# EAGLE design ha-pc-switch-revA (EAGLE 9.6.2)

## Sheet 1 of 2
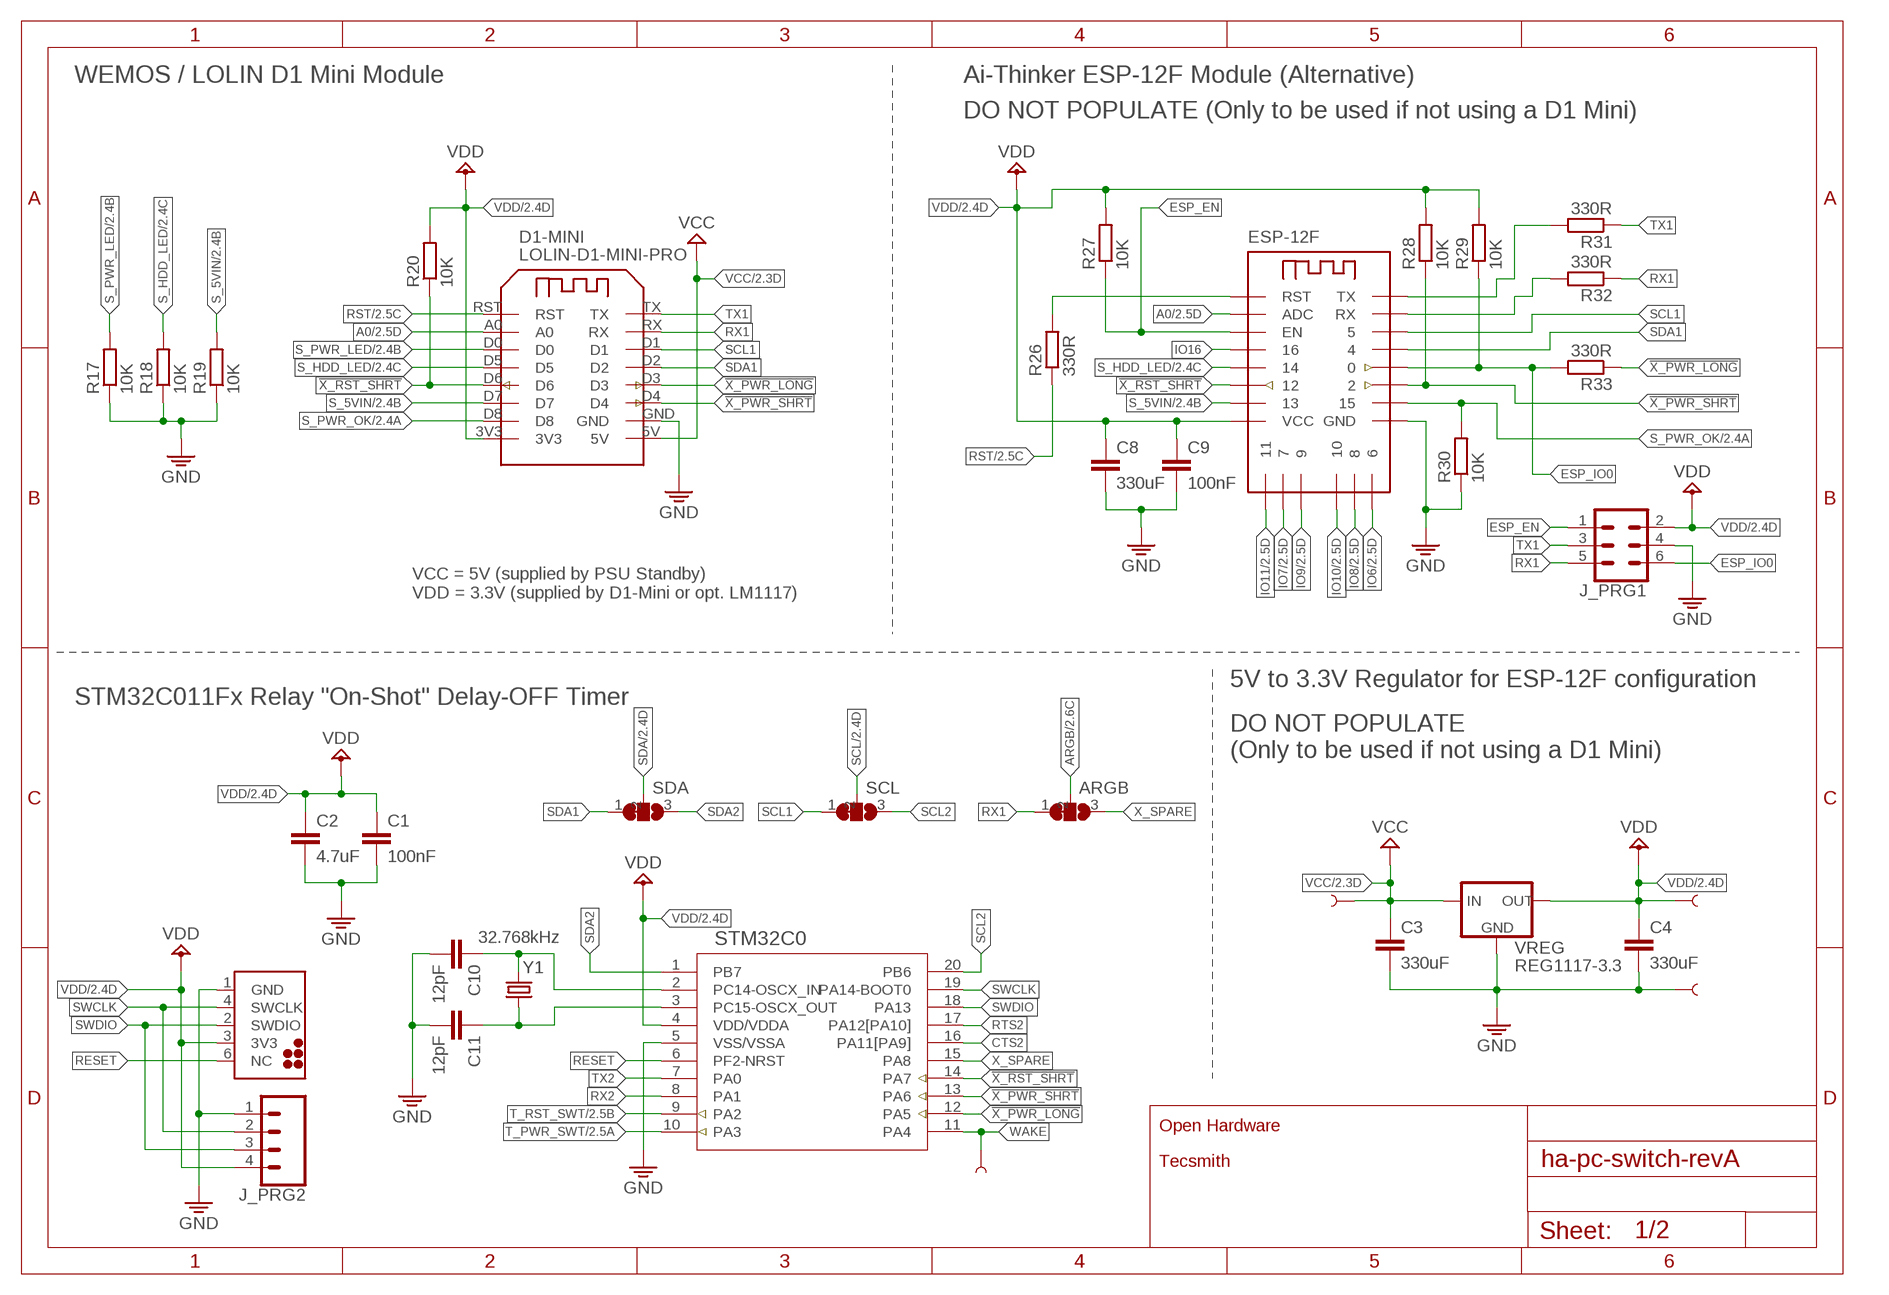
[diagram p0: schematic, sheet 1]

### Parts
ARGB  JUMPER-1X3-CLOSED  [SOLDERJUMPER_CLOSEDWIRE-3]
C1  100nF  C-EUC0603  [C0603]
C2  4.7uF  C-EUC0603  [C0603]
C3  330uF  C-EUC0603  [C0603]
C4  330uF  C-EUC0603  [C0603]
C8  330uF  C-EUC0603  [C0603]
C9  100nF  C-EUC0603  [C0603]
C10  12pF  C-EUC0603  [C0603]
C11  12pF  C-EUC0603  [C0603]
D1-MINI  LOLIN-D1-MINI-PRO  [WEMOS-D1-MINI-PRO]
ESP-12F  ESPRESSIF-ESP-12F&ESMD  [ESP8266-ESP-12E]
J_DBG2  NUCLEO_HEADER  [NUCLEO]
J_PRG1  CONN_03X2FEMALE_SMD  [2X3_SMD]
J_PRG2  1X04_SMD_STRAIGHT_COMBO  CONN_04SMD_STRAIGHT_COMBO  [1X04_SMD_VERTICAL_COMBO]
LOGO1  OSHW-LOGOM  [OSHW-LOGO-M]
R17  10K  R-EU_R0603  [R0603]
R18  10K  R-EU_R0603  [R0603]
R19  10K  R-EU_R0603  [R0603]
R20  10K  R-EU_R0603  [R0603]
R26  330R  R-EU_R0603  [R0603]
R27  10K  R-EU_R0603  [R0603]
R28  10K  R-EU_R0603  [R0603]
R29  10K  R-EU_R0603  [R0603]
R30  10K  R-EU_R0603  [R0603]
R31  330R  R-EU_R0603  [R0603]
R32  330R  R-EU_R0603  [R0603]
R33  330R  R-EU_R0603  [R0603]
SCL  JUMPER-1X3-CLOSED  [SOLDERJUMPER_CLOSEDWIRE-3]
SDA  JUMPER-1X3-CLOSED  [SOLDERJUMPER_CLOSEDWIRE-3]
STM32C0  STM32C011FTSSOP20_STM-M  [TSSOP20-M]
TP1  TEST-POINT3X5  [PAD.03X.05]
TP2  TEST-POINT3X5  [PAD.03X.05]
TP3  TEST-POINT3X5  [PAD.03X.05]
TP4  TEST-POINT3X5  [PAD.03X.05]
U$1  TECSMITH-LOGOLONG  [TECSMITH-NAME]
VREG  REG1117-3.3  [SOT223]
Y1  32.768kHz  CRYSTAL-32.768KHZSMD-3.2X1.5  [CRYSTAL-SMD-3.2X1.5MM]

### Nets
!X_PWR_LONG: D1-MINI.D3 R33.1 STM32C0.12(PA5)
!X_PWR_SHRT: D1-MINI.D4 ESP-12F.GPIO2 R28.1 STM32C0.13(PA6)
!X_RST_SHRT: D1-MINI.D6 ESP-12F.GPIO12 R20.1 STM32C0.14(PA7)
A0: D1-MINI.A0 ESP-12F.ADC0(ADC) ; also sheet 2
ARGB: ARGB.2 ; also sheet 2
CTS2: STM32C0.16(PA11[PA9])
ESP_EN: ESP-12F.EN J_PRG1.1 R27.1
ESP_IO0: ESP-12F.GPIO0 J_PRG1.6 R29.1 R33.2
GND: C1.2 C2.2 C3.2 C4.2 C8.2 C9.2 C10.2 C11.2 D1-MINI.GND ESP-12F.GND J_DBG2.1(GND) J_PRG1.4 J_PRG2.1 R17.1 R18.1 R19.1 R30.1 STM32C0.5(VSS/VSSA) TP3.1 VREG.1(GND) ; also sheet 2
IO6: ESP-12F.SCLK ; also sheet 2
IO7: ESP-12F.MISO ; also sheet 2
IO8: ESP-12F.MOSI ; also sheet 2
IO9: ESP-12F.GPIO9 ; also sheet 2
IO10: ESP-12F.GPIO10 ; also sheet 2
IO11: ESP-12F.CS0 ; also sheet 2
IO16: ESP-12F.GPIO16
N$10: C10.1 STM32C0.2(PC14-OSCX_IN) Y1.P$2
N$11: C11.1 STM32C0.3(PC15-OSCX_OUT) Y1.P$1
N$14: ESP-12F.RST R26.2
N$15: ESP-12F.RXD0(RX) R32.2
N$16: ESP-12F.TXD0(TX) R31.2
RESET: J_DBG2.6(NC) STM32C0.6(PF2-NRST)
RST: D1-MINI.RST R26.1 ; also sheet 2
RTS2: STM32C0.17(PA12[PA10])
RX1: ARGB.1 D1-MINI.RX J_PRG1.5 R32.1
RX2: STM32C0.8(PA1)
S_5VIN: D1-MINI.D7 ESP-12F.GPIO13 R19.2 ; also sheet 2
S_HDD_LED: D1-MINI.D5 ESP-12F.GPIO14 R18.2 ; also sheet 2
S_PWR_LED: D1-MINI.D0 R17.2 ; also sheet 2
S_PWR_OK: D1-MINI.D8 ESP-12F.GPIO15 R30.2 ; also sheet 2
SCL: SCL.2 ; also sheet 2
SCL1: D1-MINI.D1 ESP-12F.GPIO5 SCL.1
SCL2: SCL.3 STM32C0.20(PB6)
SDA: SDA.2 ; also sheet 2
SDA1: D1-MINI.D2 ESP-12F.GPIO4 SDA.1
SDA2: SDA.3 STM32C0.1(PB7)
SWCLK: J_DBG2.4(SWCLK) J_PRG2.2 STM32C0.19(PA14-BOOT0)
SWDIO: J_DBG2.2(SWDIO) J_PRG2.3 STM32C0.18(PA13)
T_PWR_SWT: STM32C0.10(PA3) ; also sheet 2
T_RST_SWT: STM32C0.9(PA2) ; also sheet 2
TX1: D1-MINI.TX J_PRG1.3 R31.1
TX2: STM32C0.7(PA0)
VCC: C3.1 D1-MINI.5V TP1.1 VREG.3(IN) ; also sheet 2
VDD: C1.1 C2.1 C4.1 C8.1 C9.1 D1-MINI.3V3 ESP-12F.VCC J_DBG2.3(3V3) J_PRG1.2 J_PRG2.4 R20.2 R27.2 R28.2 R29.2 STM32C0.4(VDD/VDDA) TP2.1 VREG.2(OUT) VREG.T(OUT) ; also sheet 2
WAKE: STM32C0.11(PA4) TP4.1
X_SPARE: ARGB.3 STM32C0.15(PA8)

### Notes on the sheet
- WEMOS / LOLIN D1 Mini Module | Ai-Thinker ESP-12F Module (Alternative)
- DO NOT POPULATE (Only to be used if not using a D1 Mini)
- VCC = 5V (supplied by PSU Standby)
  VDD = 3.3V (supplied by D1-Mini or opt. LM1117)
- 5V to 3.3V Regulator for ESP-12F configuration
- STM32C011Fx Relay "On-Shot" Delay-OFF Timer
- DO NOT POPULATE
  (Only to be used if not using a D1 Mini)

## Sheet 2 of 2
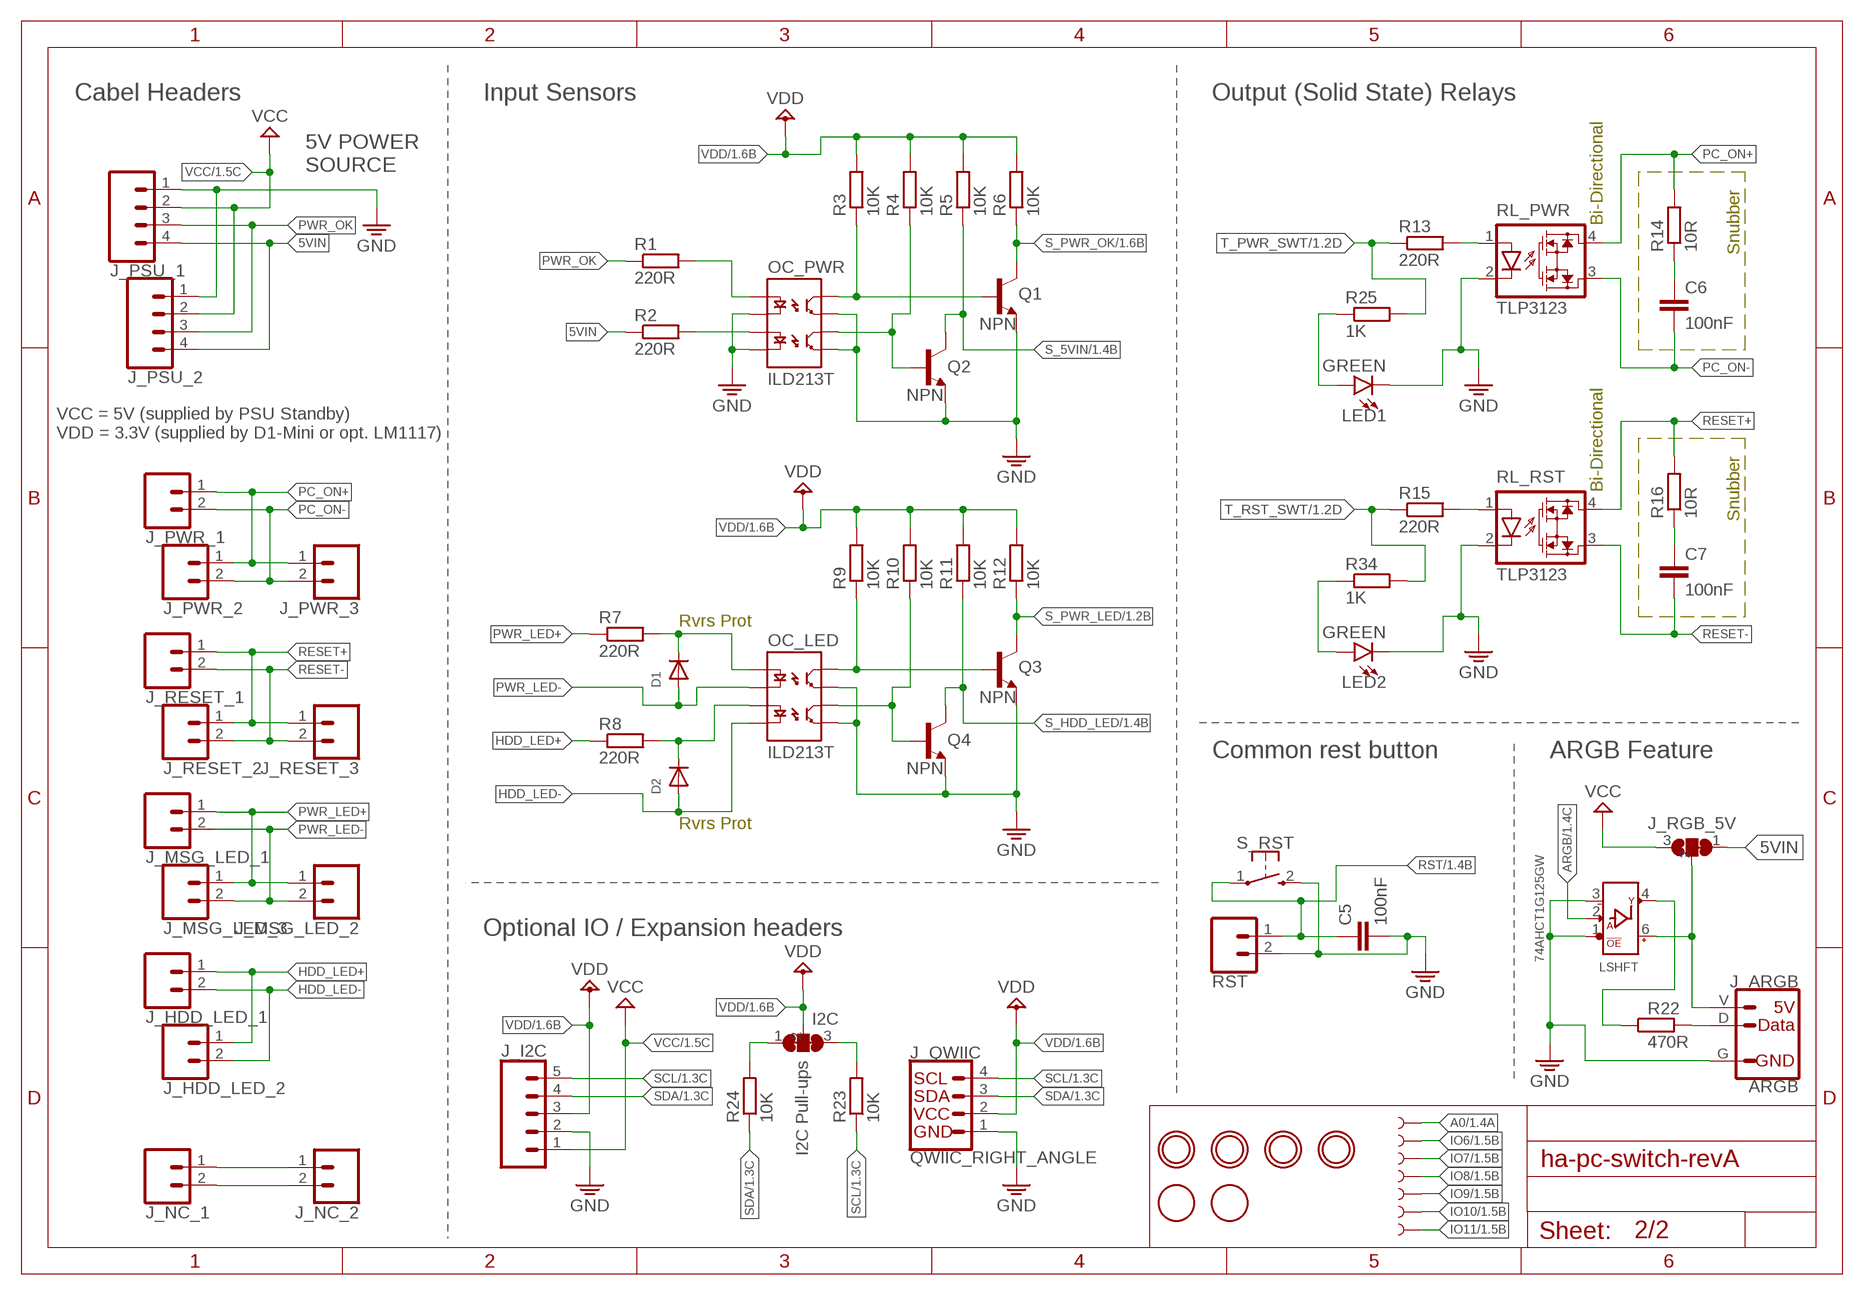
[diagram p1: schematic, sheet 2]

### Parts
C5  100nF  C-EUC0603  [C0603]
C6  100nF  C-EUC0603  [C0603]
C7  100nF  C-EUC0603  [C0603]
D1  DIODESOD-523  [SOD-523]
D2  DIODESOD-523  [SOD-523]
I2C  JUMPER-1X3-CLOSED-2  [SOLDERJUMPER_CLOSEDWIRE-3-2]
J_ARGB  ARGB  [ARGB]
J_HDD_LED_1  CONN_021X02_NO_SILK  [1X02_NO_SILK]
J_HDD_LED_2  CONN_021X02_NO_SILK  [1X02_NO_SILK]
J_I2C  CONN_05SCREW  [SCREWTERMINAL-3.5MM-5]
J_MSG_LED_1  CONN_021X02_NO_SILK  [1X02_NO_SILK]
J_MSG_LED_2  CONN_021X02_NO_SILK  [1X02_NO_SILK]
J_MSG_LED_3  CONN_02PTH3  [1X02_LONGPADS]
J_NC_1  CONN_021X02_NO_SILK  [1X02_NO_SILK]
J_NC_2  CONN_021X02_NO_SILK  [1X02_NO_SILK]
J_PSU_1  CONN_04LONGPADS  [1X04_LONGPADS]
J_PSU_2  CONN_04SCREW  [SCREWTERMINAL-3.5MM-4]
J_PWR_1  CONN_021X02_NO_SILK  [1X02_NO_SILK]
J_PWR_2  CONN_021X02_NO_SILK  [1X02_NO_SILK]
J_PWR_3  CONN_02PTH3  [1X02_LONGPADS]
J_QWIIC  QWIIC_RIGHT_ANGLE  QWIIC_CONNECTORJS-1MM  [JST04_1MM_RA]
J_RESET_1  CONN_021X02_NO_SILK  [1X02_NO_SILK]
J_RESET_2  CONN_021X02_NO_SILK  [1X02_NO_SILK]
J_RESET_3  CONN_02PTH3  [1X02_LONGPADS]
J_RGB_5V  JUMPER-1X3-CLOSEDPINS  [1X03_ROUND_CLOSED]
LED1  GREEN  LED-GREEN0603  [LED-0603]
LED2  GREEN  LED-GREEN0603  [LED-0603]
LSHFT  74AHCT1G125GW  [SC-88A__TSSOP5__SOT353-1]
OC_LED  ILD213T  OPTOISOLATOR-2SOIC8  [SO08-2]
OC_PWR  ILD213T  OPTOISOLATOR-2SOIC8  [SO08-2]
Q1  NPN  TRANSISTOR_NPNSOT23-3  [SOT23-3]
Q2  NPN  TRANSISTOR_NPNSOT23-3  [SOT23-3]
Q3  NPN  TRANSISTOR_NPNSOT23-3  [SOT23-3]
Q4  NPN  TRANSISTOR_NPNSOT23-3  [SOT23-3]
R1  220R  R-EU_R0603  [R0603]
R2  220R  R-EU_R0603  [R0603]
R3  10K  R-EU_R0603  [R0603]
R4  10K  R-EU_R0603  [R0603]
R5  10K  R-EU_R0603  [R0603]
R6  10K  R-EU_R0603  [R0603]
R7  220R  R-EU_R0603  [R0603]
R8  220R  R-EU_R0603  [R0603]
R9  10K  R-EU_R0603  [R0603]
R10  10K  R-EU_R0603  [R0603]
R11  10K  R-EU_R0603  [R0603]
R12  10K  R-EU_R0603  [R0603]
R13  220R  R-EU_R0603  [R0603]
R14  10R  R-EU_R0603  [R0603]
R15  220R  R-EU_R0603  [R0603]
R16  10R  R-EU_R0603  [R0603]
R22  470R  R-EU_R0603  [R0603]
R23  10K  R-EU_R0603  [R0603]
R24  10K  R-EU_R0603  [R0603]
R25  1K  R-EU_R0603  [R0603]
R34  1K  R-EU_R0603  [R0603]
RL_PWR  TLP3123  [SOP4_TOS]
RL_RST  TLP3123  [SOP4_TOS]
RST  CONN_021X02_NO_SILK  [1X02_NO_SILK]
S_RST  MOMENTARY-SWITCH-SPST-1  [SKRKAEE020]
TP9  TEST-POINT3X5  [PAD.03X.05]
TP10  TEST-POINT3X5  [PAD.03X.05]
TP11  TEST-POINT3X5  [PAD.03X.05]
TP12  TEST-POINT3X5  [PAD.03X.05]
TP14  TEST-POINT3X5  [PAD.03X.05]
TP15  TEST-POINT3X5  [PAD.03X.05]
TP16  TEST-POINT3X5  [PAD.03X.05]
U$5  MOUNTINGHOLE3.0THIN  [MOUNTINGHOLE_3.0_PLATEDTHIN]
U$9  MOUNTINGHOLE3.0THIN  [MOUNTINGHOLE_3.0_PLATEDTHIN]
U$11  MOUNTINGHOLE3.0THIN  [MOUNTINGHOLE_3.0_PLATEDTHIN]
U$12  MOUNTINGHOLE3.0THIN  [MOUNTINGHOLE_3.0_PLATEDTHIN]
U$15  FIDUCIAL  [FIDUCIAL_1MM]
U$16  FIDUCIAL  [FIDUCIAL_1MM]

### Nets
5VIN: J_PSU_1.4 J_PSU_2.4 J_RGB_5V.1 R2.1
A0: TP12.1 ; also sheet 1
ARGB: LSHFT.2(A_DIN) ; also sheet 1
GND: C5.2 J_ARGB.G J_I2C.2 J_PSU_1.1 J_PSU_2.1 J_QWIIC.1 LED1.C LED2.C LSHFT.1(!OE) LSHFT.3(3_GND) OC_LED.5(EM2) OC_LED.7(EM1) OC_PWR.2(C1) OC_PWR.4(C2) OC_PWR.5(EM2) OC_PWR.7(EM1) Q1.2(E) Q2.2(E) Q3.2(E) Q4.2(E) RL_PWR.2(C) RL_RST.2(C) RST.2 S_RST.2 ; also sheet 1
HDD_LED+: J_HDD_LED_1.1 J_HDD_LED_2.1 R8.1
HDD_LED-: D2.A J_HDD_LED_1.2 J_HDD_LED_2.2 OC_LED.4(C2)
IO6: TP11.1 ; also sheet 1
IO7: TP10.1 ; also sheet 1
IO8: TP9.1 ; also sheet 1
IO9: TP16.1 ; also sheet 1
IO10: TP15.1 ; also sheet 1
IO11: TP14.1 ; also sheet 1
N$1: OC_PWR.1(A1) R1.2
N$2: OC_PWR.3(A2) R2.2
N$3: J_NC_1.1 J_NC_2.1
N$4: J_NC_1.2 J_NC_2.2
N$5: R15.2 RL_RST.1(A)
N$6: D2.K(C) OC_LED.3(A2) R8.2
N$7: C6.1 R14.1
N$8: C7.1 R16.1
N$9: R13.2 RL_PWR.1(A)
N$12: J_ARGB.V J_RGB_5V.2 LSHFT.6(5_VCC)
N$13: D1.K(C) OC_LED.1(A1) R7.2
N$17: LSHFT.4(Y_DOUT) R22.1
N$18: J_ARGB.D R22.2
N$19: LED1.A R25.1
N$20: I2C.3 R23.2
N$21: I2C.1 R24.2
N$25: LED2.A R34.1
OUT1N: OC_PWR.8(CL1) Q1.1(B) R3.1
OUT1N1: OC_LED.8(CL1) Q3.1(B) R9.1
OUT2N: OC_PWR.6(CL2) Q2.1(B) R4.1
OUT2N1: OC_LED.6(CL2) Q4.1(B) R10.1
PC_ON+: J_PWR_1.1 J_PWR_2.1 J_PWR_3.1 R14.2 RL_PWR.4(D1)
PC_ON-: C6.2 J_PWR_1.2 J_PWR_2.2 J_PWR_3.2 RL_PWR.3(D2)
PWR_LED+: J_MSG_LED_1.1 J_MSG_LED_2.1 J_MSG_LED_3.1 R7.1
PWR_LED-: D1.A J_MSG_LED_1.2 J_MSG_LED_2.2 J_MSG_LED_3.2 OC_LED.2(C1)
PWR_OK: J_PSU_1.3 J_PSU_2.3 R1.1
RESET+: J_RESET_1.1 J_RESET_2.1 J_RESET_3.1 R16.2 RL_RST.4(D1)
RESET-: C7.2 J_RESET_1.2 J_RESET_2.2 J_RESET_3.2 RL_RST.3(D2)
RST: C5.1 RST.1 S_RST.1 ; also sheet 1
S_5VIN: Q2.3(C) R5.1 ; also sheet 1
S_HDD_LED: Q4.3(C) R11.1 ; also sheet 1
S_PWR_LED: Q3.3(C) R12.1 ; also sheet 1
S_PWR_OK: Q1.3(C) R6.1 ; also sheet 1
SCL: J_I2C.5 J_QWIIC.4 R23.1 ; also sheet 1
SDA: J_I2C.4 J_QWIIC.3 R24.1 ; also sheet 1
T_PWR_SWT: R13.1 R25.2 ; also sheet 1
T_RST_SWT: R15.1 R34.2 ; also sheet 1
VCC: J_I2C.1 J_PSU_1.2 J_PSU_2.2 J_RGB_5V.3 ; also sheet 1
VDD: I2C.2 J_I2C.3 J_QWIIC.2 R3.2 R4.2 R5.2 R6.2 R9.2 R10.2 R11.2 R12.2 ; also sheet 1

### Notes on the sheet
- Cabel Headers | Input Sensors | Output (Solid State) Relays
- 5V POWER
  SOURCE
- Snubber
- Bi-Directional
- VCC = 5V (supplied by PSU Standby)
  VDD = 3.3V (supplied by D1-Mini or opt. LM1117)
- Snubber
- Bi-Directional
- Rvrs Prot
- Common rest button | ARGB Feature
- Rvrs Prot
- Optional IO / Expansion headers
- I2C Pull-ups

## Library data of the parts
ARGB J_RGB_5V SCL SDA = ts_jumpers:JUMPER-1X3-CLOSED
C1-C11 = rcl:C-EU: CAPACITOR, European symbol; SPICEPREFIX: C
D1 D2 = adafruit:DIODE: Diode SMADIODE - SMA Surface Mount Package 20V 1A Schottky Diode Digikey: 641-1014-6-ND DO-1N4148 - Through Hole Small Current Diode SOD-123 20V 1 A (.5mV Vf) Schottky Diode - Digikey: MBRX120TPMSCT-ND SOD-323 10V 570mA (.38mV Vf, 3ns) Schottky Diode - Digikey: ZLLS410CT-ND SOD-523 30V 30mA Schottky Diode (RB751S-40TE61) - Digikey: RB751S-40TE61CT-ND SOT23-R/W - SOT23 Package (R = Solder Paste/Reflow Ovens, W = Hand-Soldering) BAT54Film 40V 300mA - Digikey: 497-7162-1-ND
D1-MINI = ts_dev_boards:LOLIN-D1-MINI-PRO
ESP-12F = ts_dev_boards:ESPRESSIF-ESP-12F&E: ESP12E Module
I2C = ts_jumpers:JUMPER-1X3-CLOSED-2
J_ARGB = __temp_to_delete:ARGB
J_DBG2 = stm32c0:NUCLEO_HEADER
J_HDD_LED_1 J_HDD_LED_2 J_MSG_LED_1-J_MSG_LED_3 J_NC_1 J_NC_2 J_PWR_1-J_PWR_3 J_RESET_1-J_RESET_3 RST = SparkFun-Connectors:CONN_02: Multi connection point. Often used as Generic Header-pin footprint for 0.1 inch spaced/style header connections On any of the 0.1 inch spaced packages, you can populate with these: Break Away Headers - Straight <https://www.sparkfun.com/products/116> (PRT-00116) Break Away Male Headers - Right Angle <https://www.sparkfun.com/products/553> (PRT-00553) Female Headers <https://www.sparkfun.com/products/115> (PRT-00115) Break Away Headers - Machine Pin <https://www.sparkfun.com/products/117> (PRT-00117) Break Away Female Headers - Swiss Machine Pin <https://www.sparkfun.com/products/743> (PRT-00743) For SCREWTERMINALS and SPRING TERMINALS visit here: Screw Terimnals on SparkFun.com <https://www.sparkfun.com/search/results?term=Screw+Terminals> (5mm/3.5mm/2.54mm spacing) This device is also useful as a general connection point to wire up your design to another part of your project. Our various solder wires solder well into these plated through hole pads. Hook-Up Wire - Assortment (Stranded, 22 AWG) <https://www.sparkfun.com/products/11375> (PRT-11375) Hook-Up Wire - Assortment (Solid Core, 22 AWG) <https://www.sparkfun.com/products/11367> (PRT-11367) View the entire wire category on our website here <https://www.sparkfun.com/categories/141> Special notes: Molex polarized connector foot print use with: PRT-08233 with associated crimp pins and housings. 2.54_SCREWTERM for use with PRT-10571. 3.5mm Screw Terminal footprints for PRT-08084 5mm Screw Terminal footprints for use with PRT-08432
J_I2C = SparkFun-Connectors:CONN_05: Multi connection point. Often used as Generic Header-pin footprint for 0.1 inch spaced/style header connections On any of the 0.1 inch spaced packages, you can populate with these: Break Away Headers - Straight <https://www.sparkfun.com/products/116> (PRT-00116) Break Away Male Headers - Right Angle <https://www.sparkfun.com/products/553> (PRT-00553) Female Headers <https://www.sparkfun.com/products/115> (PRT-00115) Break Away Headers - Machine Pin <https://www.sparkfun.com/products/117> (PRT-00117) Break Away Female Headers - Swiss Machine Pin <https://www.sparkfun.com/products/743> (PRT-00743) For SCREWTERMINALS and SPRING TERMINALS visit here: Screw Terimnals on SparkFun.com <https://www.sparkfun.com/search/results?term=Screw+Terminals> (5mm/3.5mm/2.54mm spacing) This device is also useful as a general connection point to wire up your design to another part of your project. Our various solder wires solder well into these plated through hole pads. Hook-Up Wire - Assortment (Stranded, 22 AWG) <https://www.sparkfun.com/products/11375> (PRT-11375) Hook-Up Wire - Assortment (Solid Core, 22 AWG) <https://www.sparkfun.com/products/11367> (PRT-11367) View the entire wire category on our website here <https://www.sparkfun.com/categories/141> Special notes: Molex polarized connector foot print use with SKU : PRT-08231 with associated crimp pins and housings. 1MM SMD Version SKU: PRT-10208; PROD_ID: Combine 8288+8399
J_PRG1 = SparkFun-Connectors:CONN_03X2: Multi connection point. Often used as Generic Header-pin footprint for 0.1 inch spaced/style header connections You can populate with any combo of single row headers, but if you'd like an exact match, check these: Header - 2x3 (Male, 0.1") <https://www.sparkfun.com/products/12807> (PRT-12807) Header - 2x3 (Female, 0.1") <https://www.sparkfun.com/products/13010> (PRT-13010) 2x3 Pin Shrouded Header <https://www.sparkfun.com/products/10877> (PRT-10877) On any of the 0.1 inch spaced packages, you can populate with these: Break Away Headers - Straight <https://www.sparkfun.com/products/116> (PRT-00116) Break Away Male Headers - Right Angle <https://www.sparkfun.com/products/553> (PRT-00553) Female Headers <https://www.sparkfun.com/products/115> (PRT-00115) Break Away Headers - Machine Pin <https://www.sparkfun.com/products/117> (PRT-00117) Break Away Female Headers - Swiss Machine Pin <https://www.sparkfun.com/products/743> (PRT-00743) Special note: the shrouded connector mates well with our 3x2 ribbon cables: Ribbon Crimp Connector - 6-pin (2x3, Female) <https://www.sparkfun.com/products/10651> (PRT-10651) Ribbon Cable - 6 wire (15ft) <https://www.sparkfun.com/products/10646> (PRT-10646); PROD_ID: CONN-11290
J_PRG2 = SparkFun-Connectors:CONN_04: Multi connection point. Often used as Generic Header-pin footprint for 0.1 inch spaced/style header connections On any of the 0.1 inch spaced packages, you can populate with these: Break Away Headers - Straight <https://www.sparkfun.com/products/116> (PRT-00116) Break Away Male Headers - Right Angle <https://www.sparkfun.com/products/553> (PRT-00553) Female Headers <https://www.sparkfun.com/products/115> (PRT-00115) Break Away Headers - Machine Pin <https://www.sparkfun.com/products/117> (PRT-00117) Break Away Female Headers - Swiss Machine Pin <https://www.sparkfun.com/products/743> (PRT-00743) For SCREWTERMINALS and SPRING TERMINALS visit here: Screw Terimnals on SparkFun.com <https://www.sparkfun.com/search/results?term=Screw+Terminals> (5mm/3.5mm/2.54mm spacing) This device is also useful as a general connection point to wire up your design to another part of your project. Our various solder wires solder well into these plated through hole pads. Hook-Up Wire - Assortment (Stranded, 22 AWG) <https://www.sparkfun.com/products/11375> (PRT-11375) Hook-Up Wire - Assortment (Solid Core, 22 AWG) <https://www.sparkfun.com/products/11367> (PRT-11367) View the entire wire category on our website here <https://www.sparkfun.com/categories/141> Special notes: Molex polarized connector foot print use with SKU : PRT-08231 with associated crimp pins and housings. 1MM SMD Version SKU: PRT-10208; PROD_ID: CONN-08511
J_PSU_1 = SparkFun-Connectors:CONN_04: Multi connection point. Often used as Generic Header-pin footprint for 0.1 inch spaced/style header connections On any of the 0.1 inch spaced packages, you can populate with these: Break Away Headers - Straight <https://www.sparkfun.com/products/116> (PRT-00116) Break Away Male Headers - Right Angle <https://www.sparkfun.com/products/553> (PRT-00553) Female Headers <https://www.sparkfun.com/products/115> (PRT-00115) Break Away Headers - Machine Pin <https://www.sparkfun.com/products/117> (PRT-00117) Break Away Female Headers - Swiss Machine Pin <https://www.sparkfun.com/products/743> (PRT-00743) For SCREWTERMINALS and SPRING TERMINALS visit here: Screw Terimnals on SparkFun.com <https://www.sparkfun.com/search/results?term=Screw+Terminals> (5mm/3.5mm/2.54mm spacing) This device is also useful as a general connection point to wire up your design to another part of your project. Our various solder wires solder well into these plated through hole pads. Hook-Up Wire - Assortment (Stranded, 22 AWG) <https://www.sparkfun.com/products/11375> (PRT-11375) Hook-Up Wire - Assortment (Solid Core, 22 AWG) <https://www.sparkfun.com/products/11367> (PRT-11367) View the entire wire category on our website here <https://www.sparkfun.com/categories/141> Special notes: Molex polarized connector foot print use with SKU : PRT-08231 with associated crimp pins and housings. 1MM SMD Version SKU: PRT-10208; PROD_ID: CONN-09696
J_PSU_2 = SparkFun-Connectors:CONN_04: Multi connection point. Often used as Generic Header-pin footprint for 0.1 inch spaced/style header connections On any of the 0.1 inch spaced packages, you can populate with these: Break Away Headers - Straight <https://www.sparkfun.com/products/116> (PRT-00116) Break Away Male Headers - Right Angle <https://www.sparkfun.com/products/553> (PRT-00553) Female Headers <https://www.sparkfun.com/products/115> (PRT-00115) Break Away Headers - Machine Pin <https://www.sparkfun.com/products/117> (PRT-00117) Break Away Female Headers - Swiss Machine Pin <https://www.sparkfun.com/products/743> (PRT-00743) For SCREWTERMINALS and SPRING TERMINALS visit here: Screw Terimnals on SparkFun.com <https://www.sparkfun.com/search/results?term=Screw+Terminals> (5mm/3.5mm/2.54mm spacing) This device is also useful as a general connection point to wire up your design to another part of your project. Our various solder wires solder well into these plated through hole pads. Hook-Up Wire - Assortment (Stranded, 22 AWG) <https://www.sparkfun.com/products/11375> (PRT-11375) Hook-Up Wire - Assortment (Solid Core, 22 AWG) <https://www.sparkfun.com/products/11367> (PRT-11367) View the entire wire category on our website here <https://www.sparkfun.com/categories/141> Special notes: Molex polarized connector foot print use with SKU : PRT-08231 with associated crimp pins and housings. 1MM SMD Version SKU: PRT-10208; PROD_ID: CONN-14485
J_QWIIC = ts_custom_nick_nacks:QWIIC_CONNECTOR: SparkFun I2C Standard Qwiic Connector An SMD 1mm pitch JST connector makes it easy and quick (get it? Qwiic?) to connect I2C devices to each other. The Qwiic system <http://www.sparkfun.com/qwiic> enables fast and solderless connection between popular platforms and various sensors and actuators. We carry 200mm <https://www.sparkfun.com/products/14204>, 100mm <https://www.sparkfun.com/products/14205>, 50mm <https://www.sparkfun.com/products/14206>, and breadboard friendly <https://www.sparkfun.com/products/14207> Qwiic cables. We also offer 10 pcs strips <https://www.sparkfun.com/products/14323> the SMD connectors.; PROD_ID: CONN-13694
LED1 LED2 = SparkFun-LED:LED-GREEN: Green SMD LED Used in manufacturing of various products at SparkFun Packages: 0603 - SMD 0603 package [Product Link] <http://www.futureelectronics.com/en/technologies/semiconductors/optoelectronics/leds/Pages/9894312-LTST-C190GKT.aspx?CrossPart=HSMG-C190&IM=0> LilyPad 1206 - SMD1206 LilyPad package [Product Link] <http://www.futureelectronics.com/en/Technologies/Product.aspx?ProductID=IN150NGHARVATEKCORPORATION2049943&IM=0> 1206 - SMD1206 package [Product Link] <http://www.futureelectronics.com/en/technologies/semiconductors/optoelectronics/leds/Pages/8315665-LTST-C150KGKT.aspx?IM=0> 1206 Bottom Mount -SMD 1206 Bottom Mount [Product Link] <http://www.digikey.com/product-detail/en/lite-on-inc/LTST-C230KGKT/160-1456-1-ND/386854> SparkFun Products: Pro Mini 328 -5V <https://www.sparkfun.com/products/821> RedBoard <https://www.sparkfun.com/products/12757> MP3 Trigger <https://www.sparkfun.com/products/13720> Makey Makey <https://www.sparkfun.com/products/11076>; PROD_ID: DIO-00821
LOGO1 = random_logos:OSHW-LOGO: Open-Source Hardware (OSHW) Logo This logo indicates the piece of hardware it is found on incorporates a OSHW license and/or adheres to the definition of open source hardware found here: http://freedomdefined.org/OSHW
LSHFT = ts_keyboards:74AHCT1G125GW
OC_LED OC_PWR = SparkFun:OPTOISOLATOR-2: Description: Dual gate opto isolator. Vishay part : ILD213T
Q1-Q4 = SparkFun:TRANSISTOR_NPN: Transistor NPN BJT configuration in SOT23 package. MMBT2222 is the common NPN we use. Double check BCE configuration again layout.
R1-R20 R22-R34 = rcl:R-EU_: RESISTOR, European symbol; SPICEPREFIX: R
RL_PWR RL_RST = __untitled:TLP3123
S_RST = ts_custom_nick_nacks:MOMENTARY-SWITCH-SPST-1: Momentary Switch (Pushbutton) - SPST - Two Circuits Normally-open (NO) SPST momentary switches (buttons, pushbuttons). Schematic symbol includes two switch circuits. Variants SMD-4.6MMX2.8MM - 4.60mm x 2.80mm Tactile Momentary Button Switch - Used on SparkFun SAMD21 Mini Breakout <https://www.sparkfun.com/products/13664> SMD-5.2MM - Mini Pushbutton Switch - SMD <https://www.sparkfun.com/products/8720> - Used on Arduino Pro Mini <https://www.sparkfun.com/products/11114>
STM32C0 = stm32c0:STM32C011F; COPYRIGHT: Copyright (C) 2024 Ultra Librarian. All rights reserved.; MANUFACTURER_PART_NUMBER: STM32C011F4P6; MFR_NAME: STMicroelectronics
TP1-TP4 TP9-TP12 TP14-TP16 = SparkFun-Connectors:TEST-POINT: SparkFun Test Points Bare copper test points for troubleshooting or In-Circuit-Testing. These are used by our Production team for verifying production board runs using pogo-pins on test beds. SparkFun Products: SparkFun LSM9DS1 Breakout <https://www.sparkfun.com/products/13284> SparkFun PSOC <https://www.sparkfun.com/products/13714> SparkFun Load Cell Amplifier <https://www.sparkfun.com/products/13879>
U$1 = random_logos:TECSMITH-LOGO
U$5 U$9 U$11 U$12 = ts_custom_nick_nacks:MOUNTINGHOLE: Mounting Hole For #2 screws (0.086"/2.18mm width, 0.094"/2.4mm hole) use 2.5mm; BOM: EXCLUDE
U$15 U$16 = adafruit:FIDUCIAL: For use by pick and place machines to calibrate the vision/machine, 1mm By microbuilder.eu
VREG = ts_custom_nick_nacks:REG1117-3.3: Low Dropout Positive Regulator
Y1 = SparkFun-Clocks:CRYSTAL-32.768KHZ: 32.768kHz Crystal Frequency: 32.768kHz Frequency Stability: ±20ppm Load Capacitance: 12.5pF (PTH-2X6 & SMD-3.2X1.5), 6pF (SMD-2X6) SparkFun Products: SparkFun BigTime Watch Kit <https://www.sparkfun.com/products/11734> SparkFun nRF52832 Breakout <https://www.sparkfun.com/products/13990> SparkFun Real Time Clock Module <https://www.sparkfun.com/products/12708>; PROD_ID: XTAL-13062

## Board
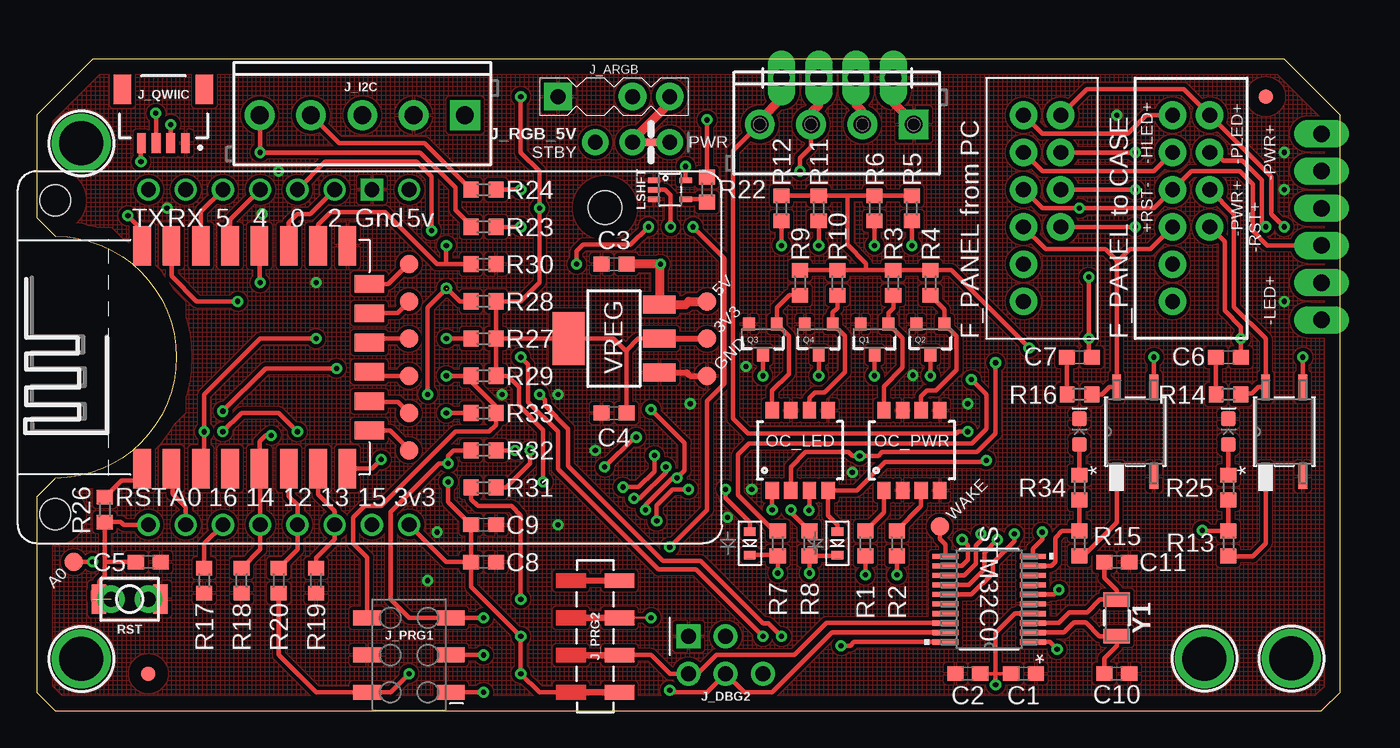
[diagram p2: board, top side]
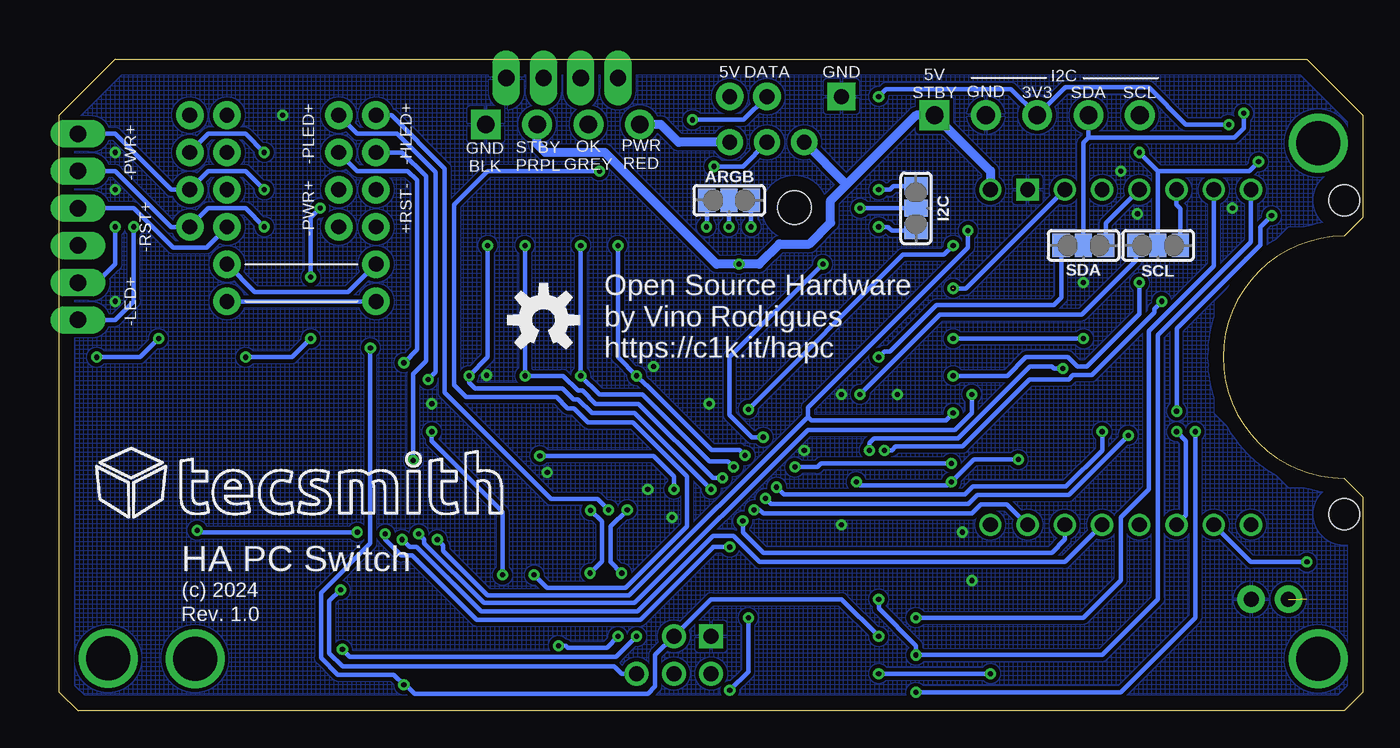
[diagram p3: board, bottom side, seen from below]

Size 88.9 x 44.45 mm. Coordinates in mm from the lower left corner, seen from the top.
Outline: 1.27,0 87.63,0 88.9,1.27 88.9,40.64 85.09,44.45 3.81,44.45 0,40.64 0,33.65 1.27,32.38 arc-180 1.27,15.88 0,14.61 0,1.27 1.27,0
Copper layers (1*16): Top 0.035mm / dielectric 1.5mm / Bottom 0.035mm
Design rules "default": minimum track width 6mil, minimum drill 0.35mm, track to track 6mil, track to pad 6mil, pad to pad 6mil, via to via 6mil, smd to smd 6mil, copper to edge 40mil, drill to drill 6mil, minimum pad ring 10mil, minimum via ring 8mil, stop-mask expansion 4mil, vias tented up to drill 0mil, thermal gap 10mil

### Footprints (pad centres in the part's own frame; a part is rotated, then mirrored left to right if it is on the bottom)
SOLDERJUMPER_CLOSEDWIRE-3 = smd 1.168 x 1.6: 1 -1.524,0; 2 0,0; 3 1.524,0 | smd 0.635 x 0.203: WIRE -0.762,0
C0603 = smd 1.1 x 1: 1 -0.85,0; 2 0.85,0
SOD-523 = smd 0.8 x 0.6: A 0,-0.8; K 0,0.8
WEMOS-D1-MINI-PRO = drill 1: 3V3 -11.43,-2.8; 5V 11.43,-2.8; A0 -11.43,12.44; D0 -11.43,9.9; D1 11.43,9.9; D2 11.43,7.36; D3 11.43,4.82; D4 11.43,2.28; D5 -11.43,7.36; D6 -11.43,4.82; D7 -11.43,2.28; D8 -11.43,-0.26; RST -11.43,14.98; RX 11.43,12.44; TX 11.43,14.98 | drill 1 square: GND 11.43,-0.26 | hole 2.1: -10.7,21.34; 10.7,21.34 | hole 2.3: 10.2,-16.16
ESP8266-ESP-12E = smd 2.7 x 1.2: ADC0 -7.6,3.5; EN -7.6,1.5; GND 7.6,-8.5; GPIO0 7.6,-2.5; GPIO2 7.6,-4.5; GPIO4 7.6,-0.5; GPIO5 7.6,1.5; GPIO12 -7.6,-4.5; GPIO13 -7.6,-6.5; GPIO14 -7.6,-2.5; GPIO15 7.6,-6.5; GPIO16 -7.6,-0.5; RST -7.6,5.5; RXD0 7.6,3.5; TXD0 7.6,5.5; VCC -7.6,-8.5 | smd 1.2 x 2: CS0 -5,-10; GPIO9 -1,-10; GPIO10 1,-10; MISO -3,-10; MOSI 3,-10; SCLK 5,-10
SOLDERJUMPER_CLOSEDWIRE-3-2 = smd 1.168 x 1.6: 1 -1.524,0; 2 0,0; 3 1.524,0 | smd 0.635 x 0.203: WIRE1 -0.762,0; WIRE2 0.762,0
ARGB = drill 1.016 pad 1.88: D 2.54,0; V 0,0 | drill 1.016 pad 1.88 square: G 7.62,0
NUCLEO = drill 1.016 pad 1.626 square: 1 -1.27,-1.27 | drill 1.016 pad 1.626: 2 1.27,-1.27; 3 -1.27,1.27; 4 1.27,1.27; 6 1.27,3.81
1X02_NO_SILK = drill 1.016 pad 1.88: 1 0,0; 2 2.54,0
SCREWTERMINAL-3.5MM-5 = drill 1.2 pad 2.032 square: 1 0,0 | drill 1.2 pad 2.032: 2 3.5,0; 3 7,0; 4 10.5,0; 5 14,0
1X02_LONGPADS = drill 1.118 pad 1.88 long: 1 0,0; 2 2.54,0
2X3_SMD = smd 1.02 x 1.9: 1 -2.54,-2.85; 2 -2.54,2.85; 3 0,-2.85; 4 0,2.85; 5 2.54,-2.85; 6 2.54,2.85
1X04_SMD_VERTICAL_COMBO = smd 1 x 2: 1 0,1.65; 2 2.54,1.65; 3 5.08,1.65; 4 7.62,1.652
1X04_LONGPADS = drill 1.118 pad 1.88 long: 1 0,0; 2 2.54,0; 3 5.08,0; 4 7.62,0
SCREWTERMINAL-3.5MM-4 = drill 1.2 pad 2.032 square: 1 0,0 | drill 1.2 pad 2.032: 2 3.5,0; 3 7,0; 4 10.5,0
JST04_1MM_RA = smd 0.6 x 1.35: 1 -1.5,0; 2 -0.5,0; 3 0.5,0; 4 1.5,0 | smd 1.2 x 2: NC1 2.8,-3.675; NC2 -2.8,-3.675
1X03_ROUND_CLOSED = drill 1 pad 1.778: 1 -1.27,0; 2 1.27,0; 3 3.81,0 | smd 1.016 x 0.508: WIRE 0,0
LED-0603 = smd 1 x 1: A -0.877,0; C 0.877,0
SC-88A__TSSOP5__SOT353-1 = smd 0.375 x 0.825: 1 -0.65,-1.087; 2 0,-1.087; 3 0.65,-1.087; 4 0.65,1.087; 6 -0.65,1.087
SO08-2 = smd 0.914 x 1.143: 1 -1.905,-2.731; 2 -0.635,-2.731; 3 0.635,-2.731; 4 1.905,-2.731; 5 1.905,2.731; 6 0.635,2.731; 7 -0.635,2.731; 8 -1.905,2.731
SOT23-3 = smd 0.8 x 0.9: 1 -0.95,-1; 2 0.95,-1; 3 0,1.1
R0603 = smd 1 x 1.1: 1 -0.85,0; 2 0.85,0
SOP4_TOS = smd 1.7 x 0.6: 1 -3.061,1.27; 2 -3.061,-1.27; 3 3.061,-1.27; 4 3.061,1.27
SKRKAEE020 = smd 1 x 2: 1 -2.1,0; 2 2.1,0
TSSOP20-M = smd 1.778 x 0.356: 1 -2.972,2.925; 2 -2.972,2.275; 3 -2.972,1.625; 4 -2.972,0.975; 5 -2.972,0.325; 6 -2.972,-0.325; 7 -2.972,-0.975; 8 -2.972,-1.625; 9 -2.972,-2.275; 10 -2.972,-2.925; 11 2.972,-2.925; 12 2.972,-2.275; 13 2.972,-1.625; 14 2.972,-0.975; 15 2.972,-0.325; 16 2.972,0.325; 17 2.972,0.975; 18 2.972,1.625; 19 2.972,2.275; 20 2.972,2.925
PAD.03X.05 = smd 1.27 x 1.27: 1 0,0
MOUNTINGHOLE_3.0_PLATEDTHIN = drill 3 pad 3.6: P$1 0,0
FIDUCIAL_1MM = smd 1 x 1: 1 0,0
SOT223 = smd 1.219 x 2.235: 1 -2.311,-3.099; 2 0,-3.099; 3 2.311,-3.099 | smd 3.6 x 2.2: T 0,3.099
CRYSTAL-SMD-3.2X1.5MM = smd 1 x 1.8: P$1 -1.25,0; P$2 1.25,0

### Placement (x,y rotation side)
ARGB  43.22,34.83 180 bottom
C1  67.31,2.54 0 top
C2  63.5,2.54 180 top
C3  39.37,30.48 180 top
C4  39.37,20.32 180 top
C5  7.62,10.16 0 top
C6  81.28,24.13 0 top
C7  71.12,24.13 0 top
C8  30.48,10.16 0 top
C9  30.48,12.7 0 top
C10  73.66,2.54 0 top
C11  73.66,10.16 0 top
D1  48.64,11.43 180 top
D1-MINI  22.61,24.13 90 top
D2  54.61,11.43 180 top
ESP-12F  12.7,24.13 90 top
I2C  30.48,34.29 270 bottom
J_ARGB  43.18,41.91 180 top
J_DBG2  45.72,3.81 270 top
J_HDD_LED_1  77.47,40.64 270 top
J_HDD_LED_2  67.31,40.64 270 top
J_I2C  29.21,40.64 180 top
J_MSG_LED_1  80.01,40.64 270 top
J_MSG_LED_2  69.85,40.64 270 top
J_MSG_LED_3  87.63,29.21 270 top
J_NC_1  77.47,27.94 90 top
J_NC_2  67.31,27.94 90 top
J_PRG1  25.4,3.81 90 top
J_PRG2  38.1,8.89 270 top
J_PSU_1  58.42,43.18 180 top
J_PSU_2  59.82,40 180 top
J_PWR_1  80.01,35.56 270 top
J_PWR_2  69.85,35.56 270 top
J_PWR_3  87.63,39.37 270 top
J_QWIIC  8.65,38.73 180 top
J_RESET_1  77.47,33.02 90 top
J_RESET_2  67.31,33.02 90 top
J_RESET_3  87.63,34.29 270 top
J_RGB_5V  41.91,38.8 180 top
LED1  81.28,19.05 90 top
LED2  71.12,19.05 90 top
LOGO1  55.88,26.67 0 bottom
LSHFT  43.18,35.56 270 top
OC_LED  52.07,17.78 0 top
OC_PWR  59.69,17.78 0 top
Q1  57.15,25.4 180 top
Q2  60.96,25.4 180 top
Q3  49.53,25.4 180 top
Q4  53.34,25.4 180 top
R1  56.52,11.43 90 top
R2  58.67,11.43 90 top
R3  58.42,29.21 90 top
R4  60.96,29.21 90 top
R5  59.69,34.29 90 top
R6  57.15,34.29 90 top
R7  50.55,11.43 270 top
R8  52.7,11.43 270 top
R9  52.07,29.21 90 top
R10  54.61,29.21 90 top
R11  53.34,34.29 90 top
R12  50.8,34.29 90 top
R13  81.28,11.43 270 top
R14  81.28,21.59 0 top
R15  71.12,11.43 270 top
R16  71.12,21.59 0 top
R17  11.43,8.89 90 top
R18  13.97,8.89 90 top
R19  19.05,8.89 90 top
R20  16.51,8.89 270 top
R22  45.72,35.56 90 top
R23  30.48,33.02 0 top
R24  30.48,35.56 0 top
R25  81.28,15.24 270 top
R26  4.65,13.73 90 top
R27  30.48,25.4 0 top
R28  30.48,27.94 0 top
R29  30.48,22.86 0 top
R30  30.48,30.48 180 top
R31  30.48,15.24 0 top
R32  30.48,17.78 0 top
R33  30.48,20.32 0 top
R34  71.12,15.24 270 top
RL_PWR  85.09,19.05 90 top
RL_RST  74.93,19.05 90 top
RST  5.08,7.62 0 top
S_RST  6.35,7.62 0 top
SCL  13.97,31.75 180 bottom
SDA  19.05,31.75 180 bottom
STM32C0  64.96,7.62 180 top
TP1  45.72,27.94 90 top
TP2  45.72,25.4 180 top
TP3  45.72,22.86 0 top
TP4  61.59,12.57 0 top
TP9  25.4,27.94 0 top
TP10  25.4,20.32 0 top
TP11  25.4,30.48 0 top
TP12  2.54,10.16 0 top
TP14  25.4,17.78 0 top
TP15  25.4,25.4 0 top
TP16  25.4,22.86 0 top
U$1  84.01,15.68 0 bottom
U$5  3.05,38.73 0 top
U$9  3.05,3.55 0 top
U$11  85.58,3.57 0 top
U$12  79.65,3.56 0 top
U$15  7.62,2.54 0 top
U$16  83.82,41.91 0 top
VREG  39.37,25.4 90 top
Y1  73.66,6.35 270 top

### Tracks (layer width: path | path; a pad name or v marks a point on that pad's centre or on a via)
5VIN  (via drill 0.35)
  Top 0.305: R2.1 v58.67,9.27 | v63.5,19.05 62.87,19.05 62.74,18.92 48.51,18.92 47.5,19.94 47.5,38.23 49.28,40 J_PSU_2.4
  Top 0.61: J_PSU_1.4 50.8,41.79 49.32,40.3 J_PSU_2.4
  Bottom 0.305: v63.5,19.05 63.5,18.41 58.67,13.59 v58.67,9.27
  Bottom 0.61: J_RGB_5V.1 46.67,38.8 47.88,40 J_PSU_2.4
!X_PWR_LONG  (via drill 0.35)
  Top 0.305: R33.1 v27.94,20.32 | D1-MINI.D3 19.69,37.46 25.91,37.46 26.92,36.45 v26.92,32.77 | v63.12,11.68 63.5,11.3 63.5,10.29 63.11,9.89 STM32C0.12
  Bottom 0.305: 37.85,20.07 50.04,7.87 59.69,7.87 62.74,10.92 62.74,11.3 v63.12,11.68 | v27.94,20.32 28.45,19.81 37.59,19.81 37.85,20.07 | 37.85,20.07 37.85,20.7 26.92,31.62 v26.92,32.77
!X_PWR_SHRT  (via drill 0.35)  (1 unrouted)
  Top 0.305: R28.1 28.87,27.94 27.98,28.83 | v27.94,28.83 27.94,28.79 26.67,27.52 v26.67,21.59 | D1-MINI.D4 19.06,34.29 19.05,34.29 18.67,33.91 17.78,33.91 17.2,33.33 ESP-12F.GPIO2 | STM32C0.13 63.28,9.25 64.07,10.03 64.07,11.3 64.39,11.62 v64.39,12.07
  Bottom 0.305: v27.94,28.83 27.06,28.83 D1-MINI.D4 | v26.67,21.59 26.67,20.32 27.81,19.18 37.85,19.18 49.66,7.37 59.94,7.37 64.01,11.43 64.01,11.68 v64.39,12.07
!X_RST_SHRT  (via drill 0.35)
  Top 0.305: ESP-12F.GPIO12 17.2,14.62 17.79,14.04 D1-MINI.D6 17.79,11.02 R20.1 | STM32C0.14 63.59,8.6 64.64,9.65 64.64,10.79 v65.53,11.68
  Bottom 0.305: D1-MINI.D6 20.33,10.16 41.15,10.16 42.93,11.94 44.32,11.94 49.48,6.78 60.13,6.78 64.53,11.18 65.02,11.18 v65.53,11.68
A0  (via drill 0.35)
  Top 0.305: TP12.1 v3.81,10.16 | ESP-12F.ADC0 9.27,16.46 9.27,14.8 10.17,13.9 D1-MINI.A0
  Bottom 0.305: D1-MINI.A0 7.63,10.16 v3.81,10.16
ARGB  (via drill 0.35)
  Top 0.305: LSHFT.2 42.86,35.56 43.24,35.18 v43.24,33.02
  Bottom 0.305: ARGB.2 43.22,33.04 v43.24,33.02
ESP_EN  (via drill 0.35)
  Top 0.305: R27.1 v27.94,25.4 | v30.48,1.27 J_PRG1.1 | v19.05,25.4 15.24,25.4 11.43,21.59 v11.43,19.05 11.43,16.76 ESP-12F.EN
  Bottom 0.305: v19.05,25.4 v27.94,25.4 | v30.48,1.27 16.51,1.27 11.43,6.35 v11.43,19.05
ESP_IO0  (via drill 0.35)
  Top 0.305: v27.94,22.86 R29.1 29.63,22.48 31.33,20.78 R33.2 31.33,19.52 30.86,19.05 28.57,19.05 23.49,13.97 22.35,13.97 21.59,13.21 21.59,11.43 22.55,10.47 J_PRG1.6 | v15.24,29.21 15.2,29.25 ESP-12F.GPIO0
  Bottom 0.305: v27.94,22.86 24.26,22.86 22.99,24.13 20.12,24.13 19.48,23.5 18.81,23.5 15.24,27.06 v15.24,29.21
GND  (via drill 0.35)
  Top 0.406: VREG.1 44.35,23.09 44.58,22.86 TP3.1
  Top 0.61: J_PSU_1.1 58.42,41.5 59.82,40.1 J_PSU_2.1
  other vias: 8.89,34.29 15.37,33.91 19.05,29.21 85.09,27.94 85.09,38.1 85.09,35.56 73.66,40.64 59.76,22.9 48.39,23.5 44.58,20.96 26.67,8.89 35.56,12.7 38.1,17.78 35.56,21.59 16.51,36.83 27.3,12.19 31.75,21.59 47.12,13.21 63.5,20.96 48.77,15.11 55.63,16.26
  pour Bottom (isolate 0.254, hatched): 0,1.27 1.27,0 87.63,0 88.9,1.27 88.9,40.64 85.09,44.45 3.81,44.45 0,40.64 0,34.29 1.27,33.02 3.81,33.02 5.08,33.02 10.16,27.94 10.16,20.32 5.08,15.24 3.81,15.24 1.27,15.24 0,13.97
  pour Top (isolate 0.254, hatched): 0,1.27 1.27,0 87.63,0 88.9,1.27 88.9,40.64 85.09,44.45 3.81,44.45 0,40.64 0,34.29 1.27,33.02 5.08,33.02 10.16,27.94 10.16,20.32 5.08,15.24 1.27,15.24 0,13.97
HDD_LED+  (via drill 0.35)
  Top 0.305: J_HDD_LED_1.1 75.69,40.64 74.42,39.37 68.58,39.37 J_HDD_LED_2.1 | R8.1 51.43,13.55 v51.43,13.72
  Bottom 0.305: J_HDD_LED_2.1 66.24,40.64 62.61,37.01 62.61,21.72 55.37,14.48 52.2,14.48 v51.43,13.72
HDD_LED-  (via drill 0.35)
  Top 0.305: D2.A 54.61,12.7 53.98,13.34 OC_LED.4 55.94,15.05 57.86,16.97 64.39,16.97 64.52,17.1 v64.77,17.1 | J_HDD_LED_1.2 76.2,36.83 68.58,36.83 J_HDD_LED_2.2
  Bottom 0.305: J_HDD_LED_2.2 65.51,38.1 63.88,36.47 63.88,23.86 64.77,22.97 v64.77,17.1
IO6
  Top 0.305: ESP-12F.SCLK 23.97,29.13 25.32,30.48 TP11.1
IO7
  Top 0.305: ESP-12F.MISO 22.75,21.08 24.64,21.08 TP10.1
IO8
  Top 0.305: TP9.1 25.4,27.93 24.6,27.13 ESP-12F.MOSI
IO9
  Top 0.305: TP16.1 22.97,22.86 ESP-12F.GPIO9
IO10
  Top 0.305: ESP-12F.GPIO10 22.97,25.4 TP15.1
IO11
  Top 0.305: TP14.1 25.4,17.83 24.1,19.13 ESP-12F.CS0
N$1
  Top 0.305: OC_PWR.1 57.79,13.55 R1.2
N$2
  Top 0.305: OC_PWR.3 60.32,13.97 58.67,12.32 R2.2
N$3
  Bottom 0.305: J_NC_2.1 J_NC_1.1
N$4
  Bottom 0.305: J_NC_2.2 69.22,28.57 75.57,28.57 J_NC_1.2
N$5
  Top 0.305: R15.2 71.37,10.58 73.66,12.87 RL_RST.1
N$6  (via drill 0.35)
  Top 0.305: D2.K 54.56,10.58 R8.2 v52.7,9.4 | v52.67,13.68 52.7,13.72 OC_LED.3
  Bottom 0.305: v52.67,13.68 51.91,12.92 51.91,10.2 v52.7,9.4
N$7
  Top 0.305: C6.1 R14.1
N$8
  Top 0.305: C7.1 R16.1
N$9
  Top 0.305: R13.2 81.32,10.54 82.93,10.54 83.82,11.43 RL_PWR.1
N$10
  Top 0.305: C10.1 72.81,3.59 73.66,4.44 Y1.P$2 72.48,5.1 71.55,6.03 70.75,6.03 70.07,5.35 STM32C0.2
N$11
  Top 0.305: C11.1 72.81,9.07 73.66,8.22 Y1.P$1 72.52,7.6 71.65,6.73 70.45,6.73 69.72,5.99 STM32C0.3
N$12  (via drill 0.35)
  Top 0.305: LSHFT.6 v44.27,37.14 v44.26,37.15
  Top 0.61: J_RGB_5V.2 40.95,39.1 40.95,39.24 43.18,41.48 J_ARGB.V
  Bottom 0.305: v44.26,37.15 42.29,37.15 J_RGB_5V.2
N$13  (via drill 0.35)
  Top 0.305: 48.59,10.58 D1.K 50.5,10.63 R7.2 v50.55,9.4 | v50.16,13.72 OC_LED.1
  Bottom 0.305: v50.55,9.4 51.31,10.16 51.31,12.57 v50.16,13.72
N$14
  Top 0.305: R26.2 5.8,15.73 6.65,15.73 7.2,16.28 ESP-12F.RST
N$15  (via drill 0.35)
  Top 0.305: ESP-12F.RXD0 9.2,29.66 10.92,27.94 v13.72,27.94 | R32.2 v32.64,17.78
  Bottom 0.305: v32.64,17.78 32.13,17.78 31.88,18.03 27.3,18.03 22.73,22.61 20.07,22.61 19.76,22.91 18.49,22.91 14.22,27.18 14.22,27.43 v13.72,27.94
N$16  (via drill 0.35)
  Top 0.305: ESP-12F.TXD0 7.2,32.8 v6.22,33.78 | v20.45,23.37 15.62,23.37 v12.7,20.45 | v33.66,17.78 33.66,16.89 32,15.24 R31.2
  Bottom 0.305: v6.22,33.78 6.99,33.02 6.99,31.79 7.93,30.85 | 7.93,30.85 | 7.93,30.85 12.7,26.07 v12.7,20.45 | v20.45,23.37 21.08,23.37 21.21,23.5 22.72,23.5 27.62,18.59 33.35,18.59 33.66,18.29 v33.66,17.78
N$17
  Top 0.305: LSHFT.4 45.52,34.91 R22.1
N$18  (via drill 0.35)
  Top 0.305: v45.72,40.32 R22.2
  Bottom 0.305: v45.72,40.32 42.23,40.32 J_ARGB.D
N$19
  Top 0.305: LED1.A R25.1
N$20  (via drill 0.35)
  Top 0.305: R23.2 v33.02,33.02
  Bottom 0.305: v33.02,33.02 32.38,33.02 32.13,32.77 I2C.3
N$21  (via drill 0.35)
  Top 0.305: v33.02,35.56 R24.2
  Bottom 0.305: I2C.1 32,35.81 32.26,35.56 v33.02,35.56
N$25
  Top 0.305: LED2.A R34.1
OUT1N
  Top 0.305: Q1.1 57.85,26.15 | Q1.1 58.1,27.15 58.42,27.47 R3.1 | Q1.1 59.05,25.45 59.05,23.41 57.79,22.14 OC_PWR.8
OUT1N1
  Top 0.305: R9.1 51.33,28.36 50.48,27.51 Q3.1 51.31,25.57 51.31,22.99 50.16,21.84 OC_LED.8
OUT2N
  Top 0.305: Q2.1 61.85,26.34 | Q2.1 61.91,27.38 60.96,28.33 R4.1 | Q2.1 62.74,25.57 62.74,23.24 61.34,21.84 60.71,21.84 60.32,21.46 OC_PWR.6
OUT2N1
  Top 0.305: R10.1 54.61,27.48 54.29,27.16 Q4.1 55.12,25.57 55.12,23.11 53.72,21.72 53.09,21.72 52.7,21.34 OC_LED.6
PC_ON+  (via drill 0.35)
  Top 0.305: R14.2 82.19,21.65 82.87,21.65 83.33,22.11 RL_PWR.4 83.82,25.4 81.66,27.56 81.66,33.91 J_PWR_1.1 | J_PWR_2.1 v74.93,35.56
  Bottom 0.305: J_PWR_3.1 85.09,39.37 81.28,35.56 J_PWR_1.1 78.74,36.83 76.2,36.83 v74.93,35.56
PC_ON-  (via drill 0.35)
  Top 0.305: C6.2 v82.13,25.4 82.13,26.2 81.03,27.3 81.03,32 J_PWR_1.2 | RL_PWR.3 v86.36,24.13 | v74.93,33.02 J_PWR_2.2
  Bottom 0.305: J_PWR_3.2 85.09,36.83 81.28,33.02 J_PWR_1.2 78.74,34.29 76.2,34.29 v74.93,33.02 | v86.36,24.13 83.4,24.13 v82.13,25.4
PWR_LED+  (via drill 0.35)
  Top 0.305: J_MSG_LED_2.1 71.63,42.42 78.23,42.42 J_MSG_LED_1.1 84.2,36.45 84.2,33.91 v85.09,33.02 | R7.1 50.29,12.28 47.84,14.73 47.84,17.49 48.59,18.24 63.78,18.24 64.77,19.23 64.77,21.59 v63.75,22.61
  Bottom 0.305: v85.09,33.02 85.09,30.48 86.36,29.21 J_MSG_LED_3.1 | J_MSG_LED_2.1 68.58,39.37 65.88,39.37 63.25,36.74 63.25,23.11 v63.75,22.61
PWR_LED-  (via drill 0.35)
  Top 0.305: J_MSG_LED_2.2 v74.93,38.1 | J_MSG_LED_1.2 80.39,38.1 80.95,37.54 82.23,37.54 83.57,36.21 83.57,33.27 v83.82,33.02 | v65.41,23.75 65.41,18.92 64.14,17.65 57.66,17.65 57.4,17.4 v56.13,17.4 55.63,17.4 55.37,17.65 52.45,17.65 51.43,16.64 OC_LED.2 | D1.A 48.64,12.87 46.99,14.52 v46.99,15.11
  Bottom 0.305: v74.93,38.1 76.2,39.37 78.74,39.37 J_MSG_LED_1.2 | v83.82,33.02 83.82,27.94 85.09,26.67 J_MSG_LED_3.2 | J_MSG_LED_2.2 68.58,36.83 65.15,36.83 64.52,36.2 64.52,24.64 v65.41,23.75 | v56.13,17.4 48.39,17.4 46.99,16 v46.99,15.11
PWR_OK  (via drill 0.35)
  Top 0.305: J_PSU_2.3 52.82,38.47 52.07,37.72 v52.07,36.83 | R1.1 v56.52,9.27
  Top 0.61: J_PSU_2.3 52.82,40.8 53.34,41.33 J_PSU_1.3
  Bottom 0.305: v52.07,36.83 59.69,36.83 61.98,34.54 61.98,22.23 61.15,21.4 54.99,21.4 54.23,20.64 53.78,20.64 52.83,19.68 49.78,19.68 46.1,16 46.1,12.57 50.29,8.38 55.63,8.38 v56.52,9.27
RESET  (via drill 0.35)
  Top 0.305: STM32C0.6 69.41,7.95 v69.72,8.26
  Bottom 0.305: v69.72,8.26 70.48,7.49 70.48,3.94 69.6,3.05 51.05,3.05 50.55,2.54 J_DBG2.6
RESET+
  Top 0.305: 72.35,21.97 R16.2 72.64,21.59 73.17,22.11 RL_RST.4 73.66,30.61 | J_RESET_1.1 75.95,31.5 74.55,31.5 73.66,30.61 | J_RESET_2.1 68.83,31.5 72.9,31.5 73.66,30.73 73.66,30.61
  Bottom 0.305: J_RESET_1.1 78.87,31.62 81.15,31.62 83.82,34.29 J_RESET_3.1
RESET-  (via drill 0.35)
  Top 0.305: J_RESET_3.2 83.95,31.75 82.93,32.77 82.93,35.94 82.04,36.83 78.74,36.83 J_RESET_1.2 76.2,34.29 v71.12,34.29 68.58,34.29 J_RESET_2.2 | v71.76,29.59 v71.76,25.4 71.76,24.34 C7.2 | RL_RST.3 v76.2,24.13
  Bottom 0.305: v71.12,34.29 71.76,33.65 v71.76,29.59 | v76.2,24.13 73.03,24.13 v71.76,25.4
RST  (2 unrouted)
  Top 0.305: D1-MINI.RST 5.93,12.7 5.75,12.88 R26.1 4.65,10.16 | 3.84,7.62 3.84,8.14 4.25,8.55 4.25,8.82 4.65,9.22 4.65,10.16 | C5.1 4.65,10.16
RX1  (via drill 0.35)
  Top 0.305: R32.1 28.45,17.78 28.07,17.4 v28.07,16.89 27.43,16.89 24.13,13.59 24.13,7.62 25.4,6.35 J_PRG1.5 v30.48,6.35 | v41.72,33.02 40.51,31.81 37.27,31.81 36.83,31.37 v36.83,30.48 | v38.73,16.64 40.77,18.67 v40.89,18.67
  Bottom 0.305: D1-MINI.RX 10.17,30.35 14.6,25.91 14.6,15.11 16.51,13.21 16.51,8.89 19.05,6.35 v30.48,6.35 | v28.07,16.89 36.96,16.89 37.21,16.64 v38.73,16.64 | v40.89,18.67 41.66,18.67 43.18,20.19 43.18,24.13 v36.83,30.48 | ARGB.1 41.72,34.81 v41.72,33.02
S_5VIN  (via drill 0.35)
  Top 0.305: ESP-12F.GPIO13 19.2,14.78 20.33,13.65 D1-MINI.D7 20.33,11.7 19.05,10.42 R19.2 | Q2.3 v60.96,22.86 | R5.1 v59.69,31.75 | v44.45,15.11 43.37,15.11 42.29,14.03 v42.29,12.95
  Bottom 0.305: v59.69,31.75 59.69,24.13 v60.96,22.86 60.96,22.4 60.56,21.99 54.58,21.99 53.85,21.26 53.52,21.26 52.58,20.32 49.66,20.32 v44.45,15.11 | v42.29,12.95 42.29,12.19 40.89,10.79 21.22,10.79 20.33,11.68 D1-MINI.D7
S_HDD_LED  (via drill 0.35)
  Top 0.305: R18.2 15.25,11.02 D1-MINI.D5 15.25,16.48 ESP-12F.GPIO14 15.2,18.38 15.62,18.8 v16,18.8 | Q4.3 v53.34,22.86 | R11.1 v53.34,31.75 | v42.91,16.65 42.91,16.27 41.13,14.49 v40.75,14.49
  Bottom 0.305: v53.34,31.75 v53.34,22.86 52.07,21.59 49.12,21.59 44.56,17.03 43.29,17.03 v42.91,16.65 | v40.75,14.49 40.37,14.11 26.91,14.11 26.29,14.73 20.07,14.73 v16,18.8
S_PWR_LED  (via drill 0.35)
  Top 0.305: R17.2 11.43,11.42 D1-MINI.D0 | Q3.3 v49.53,22.86 | R12.1 v50.8,31.75 | v39.98,15.26 41.06,15.26 42.14,16.34 v42.14,17.42 | v17.78,19.05 16.51,20.32 13.97,20.32 v12.7,19.05
  Bottom 0.305: v50.8,31.75 50.8,24.13 v49.53,22.86 48.89,22.23 48.85,22.23 44.43,17.8 42.52,17.8 v42.14,17.42 | v39.98,15.26 39.47,14.75 27.16,14.75 26.59,15.32 20.24,15.32 17.78,17.78 v17.78,19.05 | v12.7,19.05 12.07,18.42 12.07,13.34 D1-MINI.D0
S_PWR_OK  (via drill 0.35)
  Top 0.305: Q1.3 v57.15,22.86 | R6.1 v57.15,31.75 | ESP-12F.GPIO15 19.2,33.17 20.07,34.04 23.75,34.04 27.3,30.48 27.94,30.48 | 27.94,30.48 R30.2 | v41.52,13.72 41.52,14.04 43.36,15.88 v43.68,15.88 44.2,16.4 44.2,18.29 v41.91,20.57 | v27.94,31.75 27.94,30.48
  Bottom 0.305: v57.15,31.75 v57.15,22.86 54.55,22.86 53.53,21.84 53.21,21.84 52.32,20.96 49.39,20.96 44.31,15.88 v43.68,15.88 | v41.52,13.72 41.14,13.72 40.89,13.47 26.66,13.47 26.03,14.1 24.26,14.1 D1-MINI.D8 | v27.94,31.75 28.57,31.11 31.37,31.11 v41.91,20.57
SCL  (via drill 0.35)
  Top 0.305: R23.1 29.63,33.11 28.57,34.16 28.57,35.69 26.16,38.1 v15.24,38.1 15.24,40.61 J_I2C.5 | v7.11,37.46 7.11,38.69 J_QWIIC.4
  Bottom 0.305: 13.97,36.83 7.75,36.83 v7.11,37.46 | 13.97,36.83 SCL.2 | v15.24,38.1 13.97,36.83
SCL1
  Top 0.305: D1-MINI.D1 11.2,34.05 ESP-12F.GPIO5
  Bottom 0.305: SCL.1 12.45,34.28 12.71,34.54 D1-MINI.D1
SCL2  (via drill 0.35)
  Top 0.305: STM32C0.20 55.75,4.7 55.5,4.45 v54.86,4.45 | v50.8,5.08 49.91,5.97 49.53,5.97 45.28,10.22 42.74,10.22 36.26,16.7 36.26,19.24 34.67,20.83 34.67,21.21 v34.29,21.59
  Bottom 0.305: v54.86,4.45 54.36,4.45 54.23,4.32 51.56,4.32 v50.8,5.08 | SCL.3 15.49,30.73 19.18,27.05 28.83,27.05 v34.29,21.59
SDA  (via drill 0.35)
  Top 0.305: R24.1 26.45,38.73 20.62,38.73 J_I2C.4 | J_QWIIC.3 8.15,40.74 v8.13,40.77
  Bottom 0.305: v8.13,40.77 8.13,39.75 8.77,39.11 18.72,39.11 | 18.72,39.11 19.05,38.78 SDA.2 | J_I2C.4 18.72,39.11
SDA1
  Top 0.305: D1-MINI.D2 13.2,33.51 ESP-12F.GPIO4
  Bottom 0.305: SDA.1 17.53,33.28 D1-MINI.D2
SDA2  (via drill 0.35)
  Top 0.305: STM32C0.1 69.09,4.7 v69.6,4.19 | v49.53,5.08 44.96,9.65 42.42,9.65 35.56,16.51 35.56,19.05 33.53,21.08 33.53,23.62 v33.02,24.13
  Bottom 0.305: v69.6,4.19 69.09,3.68 50.93,3.68 v49.53,5.08 | v33.02,24.13 32.64,24.51 32.26,24.51 29.08,27.69 21.08,27.69 20.57,28.19 SDA.3
SWCLK  (via drill 0.35)
  Top 0.152: 43.3,1.27 v43.18,1.39 | v41.91,6.35 J_PRG2.2
  Top 0.305: STM32C0.19 54.24,5.35 50.16,1.27 48.26,1.27 J_DBG2.4 45.72,1.27 43.3,1.27
  Bottom 0.305: v43.18,1.39 41.91,2.66 v41.91,6.35
SWDIO
  Top 0.305: STM32C0.18 53.87,5.99 51.69,3.81 46.35,3.81 45.09,2.54 J_DBG2.2 43.18,2.54 41.91,3.81 J_PRG2.3
T_PWR_SWT  (via drill 0.35)
  Top 0.305: R25.2 R13.1 79.54,12.28 v79.5,12.32 | v68.58,12.19 68.58,11.7 67.93,11.05 STM32C0.10
  Bottom 0.305: v79.5,12.32 79.38,12.19 v68.58,12.19
T_RST_SWT
  Top 0.305: R34.2 R15.1 69.94,12.28 69.47,11.81 69.47,10.16 69.2,9.89 STM32C0.9 68.22,9.89
TX1  (via drill 0.35)
  Top 0.305: v30.48,3.81 J_PRG1.3 | R31.1 29.63,14.44 30.1,13.97 32.38,13.97 33.02,13.34 v33.02,7.62
  Bottom 0.305: D1-MINI.TX 7.63,32 13.97,25.65 13.97,7.62 17.78,3.81 v30.48,3.81 30.48,4.45 33.02,6.99 v33.02,7.62
VCC  (via drill 0.35)
  Top 0.61: J_PSU_2.2 56.32,40.9 55.88,41.34 J_PSU_1.2 | C3.1 v42.55,30.48 42.47,30.4 VREG.3 44.25,27.71 44.48,27.94 TP1.1
  Bottom 0.61: D1-MINI.5V 25.4,36.83 J_I2C.1 30.48,40.64 35.21,35.91 | J_PSU_2.2 56.32,38.66 55.75,38.1 51.69,38.1 44.07,30.48 v42.55,30.48 41.17,30.48 39.79,31.86 37.74,31.86 36.3,33.31 36.3,34.82 35.21,35.91 | J_RGB_5V.3 35.21,35.91
VDD  (via drill 0.35)
  Top 0.254: STM32C0.4 67.95,6.63 | C1.1 65.41,2.54 C2.1
  Top 0.305: R5.2 R6.2 55.28,35.14 | R12.2 R11.2 55.28,35.14 | 56.56,30.06 R3.2 R4.2 62.4,30.06 v67.69,24.77 | 56.56,30.06 R10.2 R9.2 | 55.28,35.14 55.28,31.8 56.56,30.52 56.56,30.06 | J_QWIIC.2 v9.15,40 v9.14,40 | C4.1 40.22,24.51 | 40.22,24.51 40.22,24.6 41.02,25.4 VREG.2 | R27.2 R28.2 33.02,27.94 34.29,29.21 v34.29,34.29 34.29,36.83 33.02,38.1 v33.02,41.91 | R27.2 R29.2 32.13,22.86 32.89,22.1 32.89,20.83 34.54,19.18 v34.54,15.62 | R27.2 VREG.T 39.33,25.4 40.22,24.51 | D1-MINI.3V3 27.94,10.16 C8.1 | C8.1 C9.1 28.07,14.26 v28.07,15.62 | C8.1 29.63,8.47 v33.02,5.08 v33.02,2.54 34.29,1.27 J_PRG2.4 | ESP-12F.VCC 22.88,16.53 v23.49,17.14 | R20.2 16.51,3.81 19.05,1.27 J_PRG1.2 24.13,1.27 v25.4,2.54 | v65.41,1.78 65.41,2.54 65.41,5.33 66.72,6.64 STM32C0.4
  Top 0.406: VREG.2 TP2.1
  Bottom 0.305: v9.14,40 12.06,40 14.6,42.54 20.3,42.54 J_I2C.3 23.99,42.42 32.51,42.42 v33.02,41.91 | v33.02,5.08 35.56,7.62 44.45,7.62 J_DBG2.3 48.26,3.81 48.26,1.68 48.77,1.17 64.67,1.17 65.28,1.78 v65.41,1.78 66.1,2.48 69.91,2.48 71.06,3.62 71.06,8.07 67.69,11.43 v67.69,24.77 | I2C.2 v34.29,34.29 | v23.49,17.14 26.54,17.14 v28.07,15.62 28.32,15.37 34.29,15.37 v34.54,15.62 | v33.02,2.54 v25.4,2.54
WAKE
  Top 0.305: STM32C0.11 61.99,11.35 61.59,11.75 TP4.1
X_SPARE  (via drill 0.35)
  Top 0.305: v43.18,11.18 45.72,13.72 45.72,21.16 46.91,22.35 46.91,30.48 46.91,30.87 v44.77,33.02 | STM32C0.15 63.76,7.95 65.21,9.4 65.21,10.1 66.68,11.56 v66.68,12.07
  Bottom 0.305: v43.18,11.18 44.32,11.18 44.32,11.17 49.26,6.22 60.45,6.22 64.83,10.6 65.59,10.6 66.68,11.68 v66.68,12.07 | ARGB.3 44.74,33.04 v44.77,33.02

### Text on the board
tPlace: 5V | 3V3 | F_PANEL from PC | F_PANEL to CASE | GND | WAKE | A0
bPlace: Open Source Hardware / by Vino Rodrigues / https://c1k.it/hapc | HA PC Switch | (c) 2024 | Rev. 1.0
tNames: -HLED+ | -PLED+ | PWR | STBY | -PWR+ | +RST- | -PWR+ | -RST+ | -LED+
bNames: I2C | GND | DATA | 5V | SCL | SDA | 3V3 | GND | 5V / STBY | -HLED+ | -PLED+ | PWR / RED | OK / GREY | STBY / PRPL | GND / BLK | -PWR+ | +RST- | -PWR+ | -RST+ | -LED+
Document: 2.5-inch HDD footprint / (+-0.25mm) | CHANGE GRID TO 50mil W/ 5mil STEPS
Reference: 92mm Fan footprint / (+-.25mm)